# Altium schematic sheet 40.SchDoc
size 513 x 386 mm
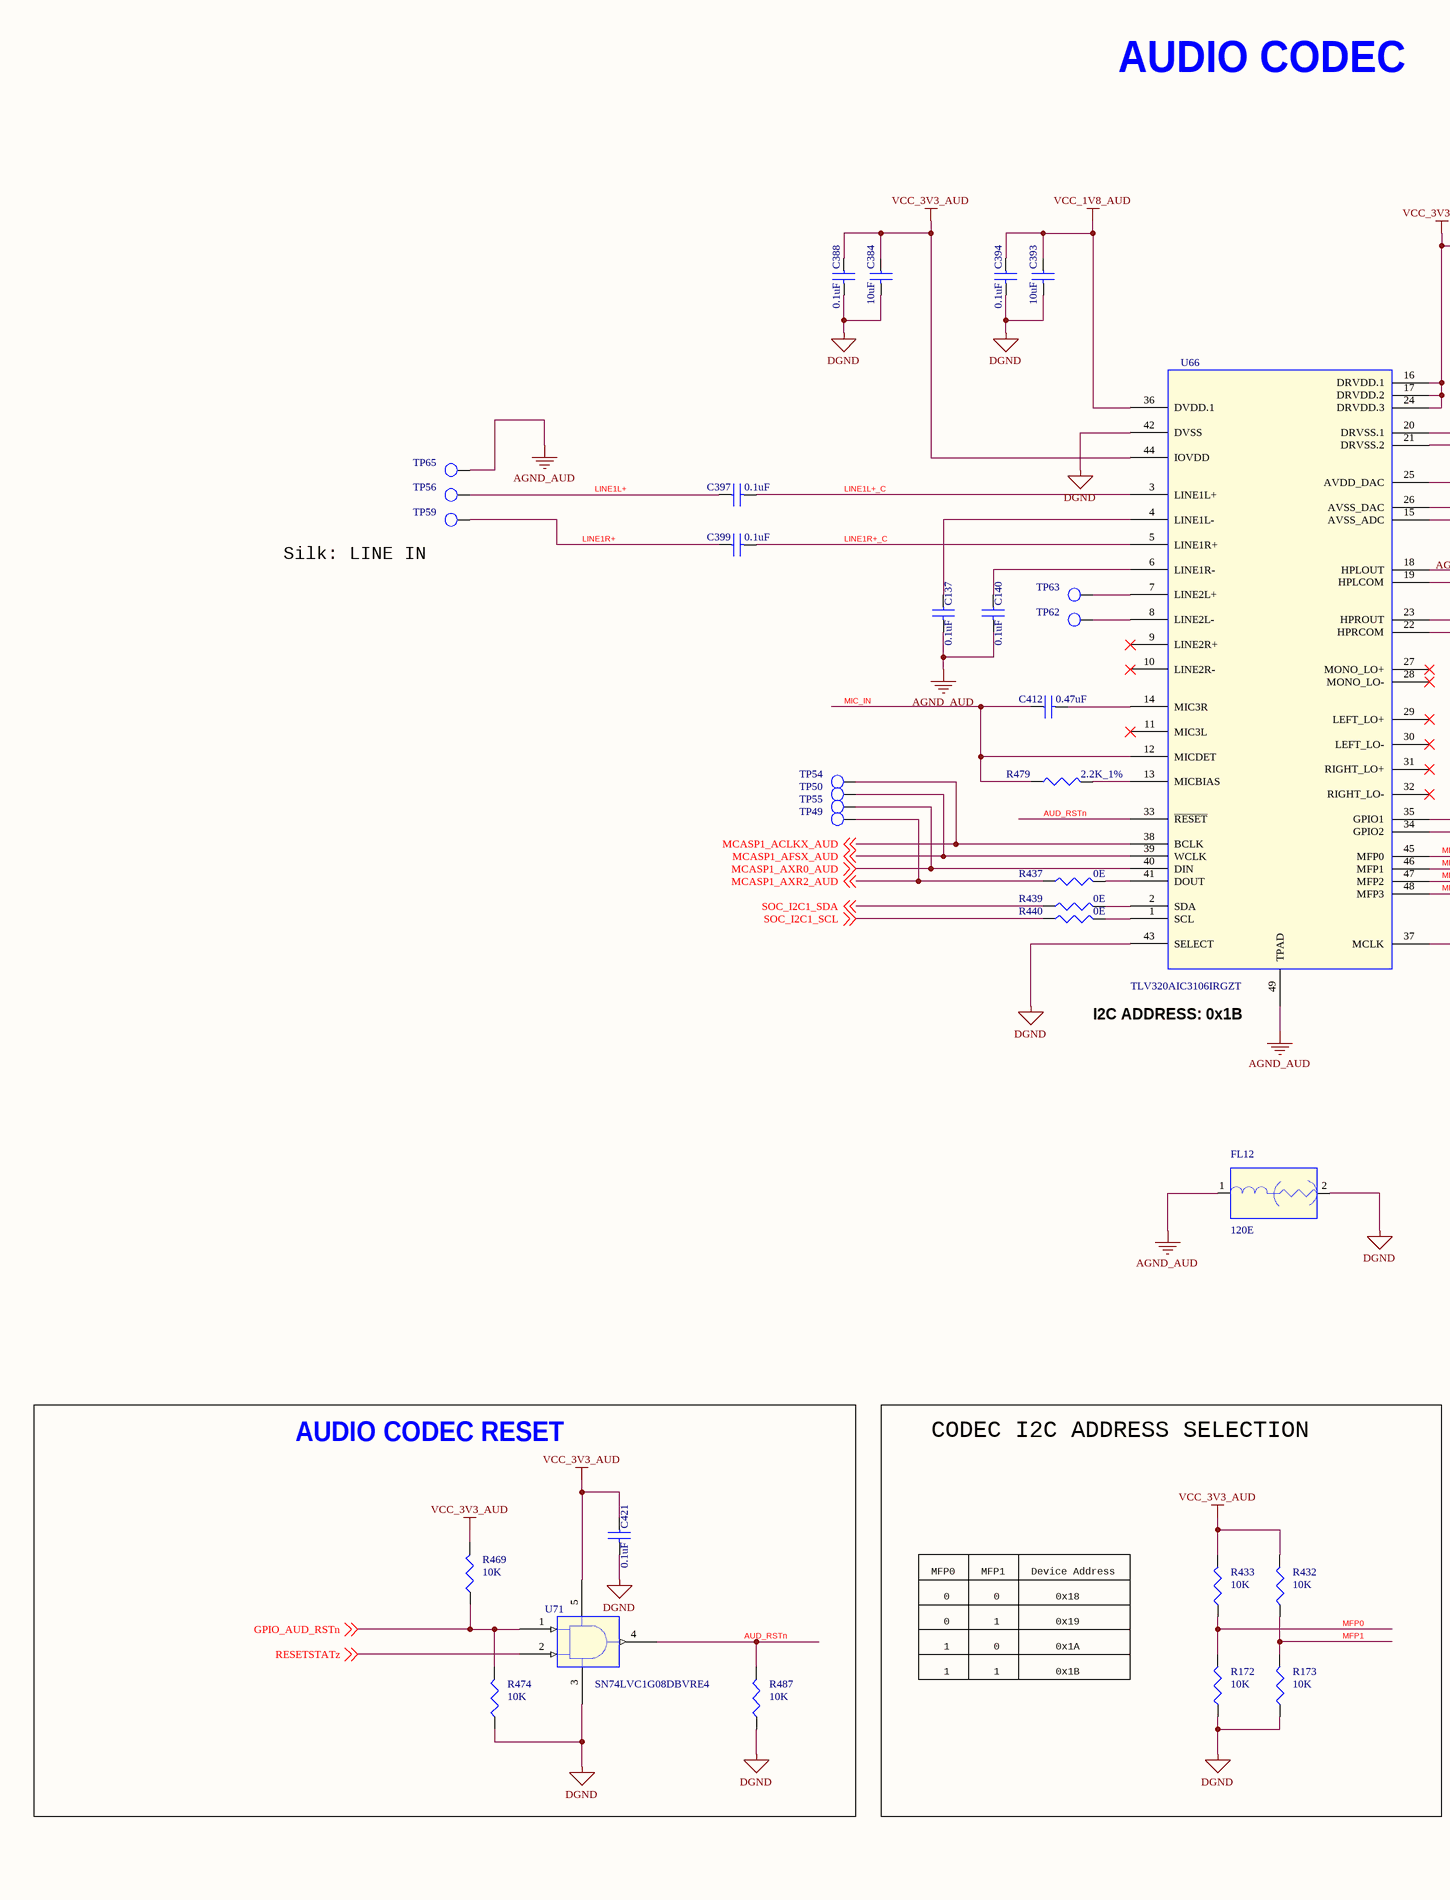
[diagram p0: 40.SchDoc, left]
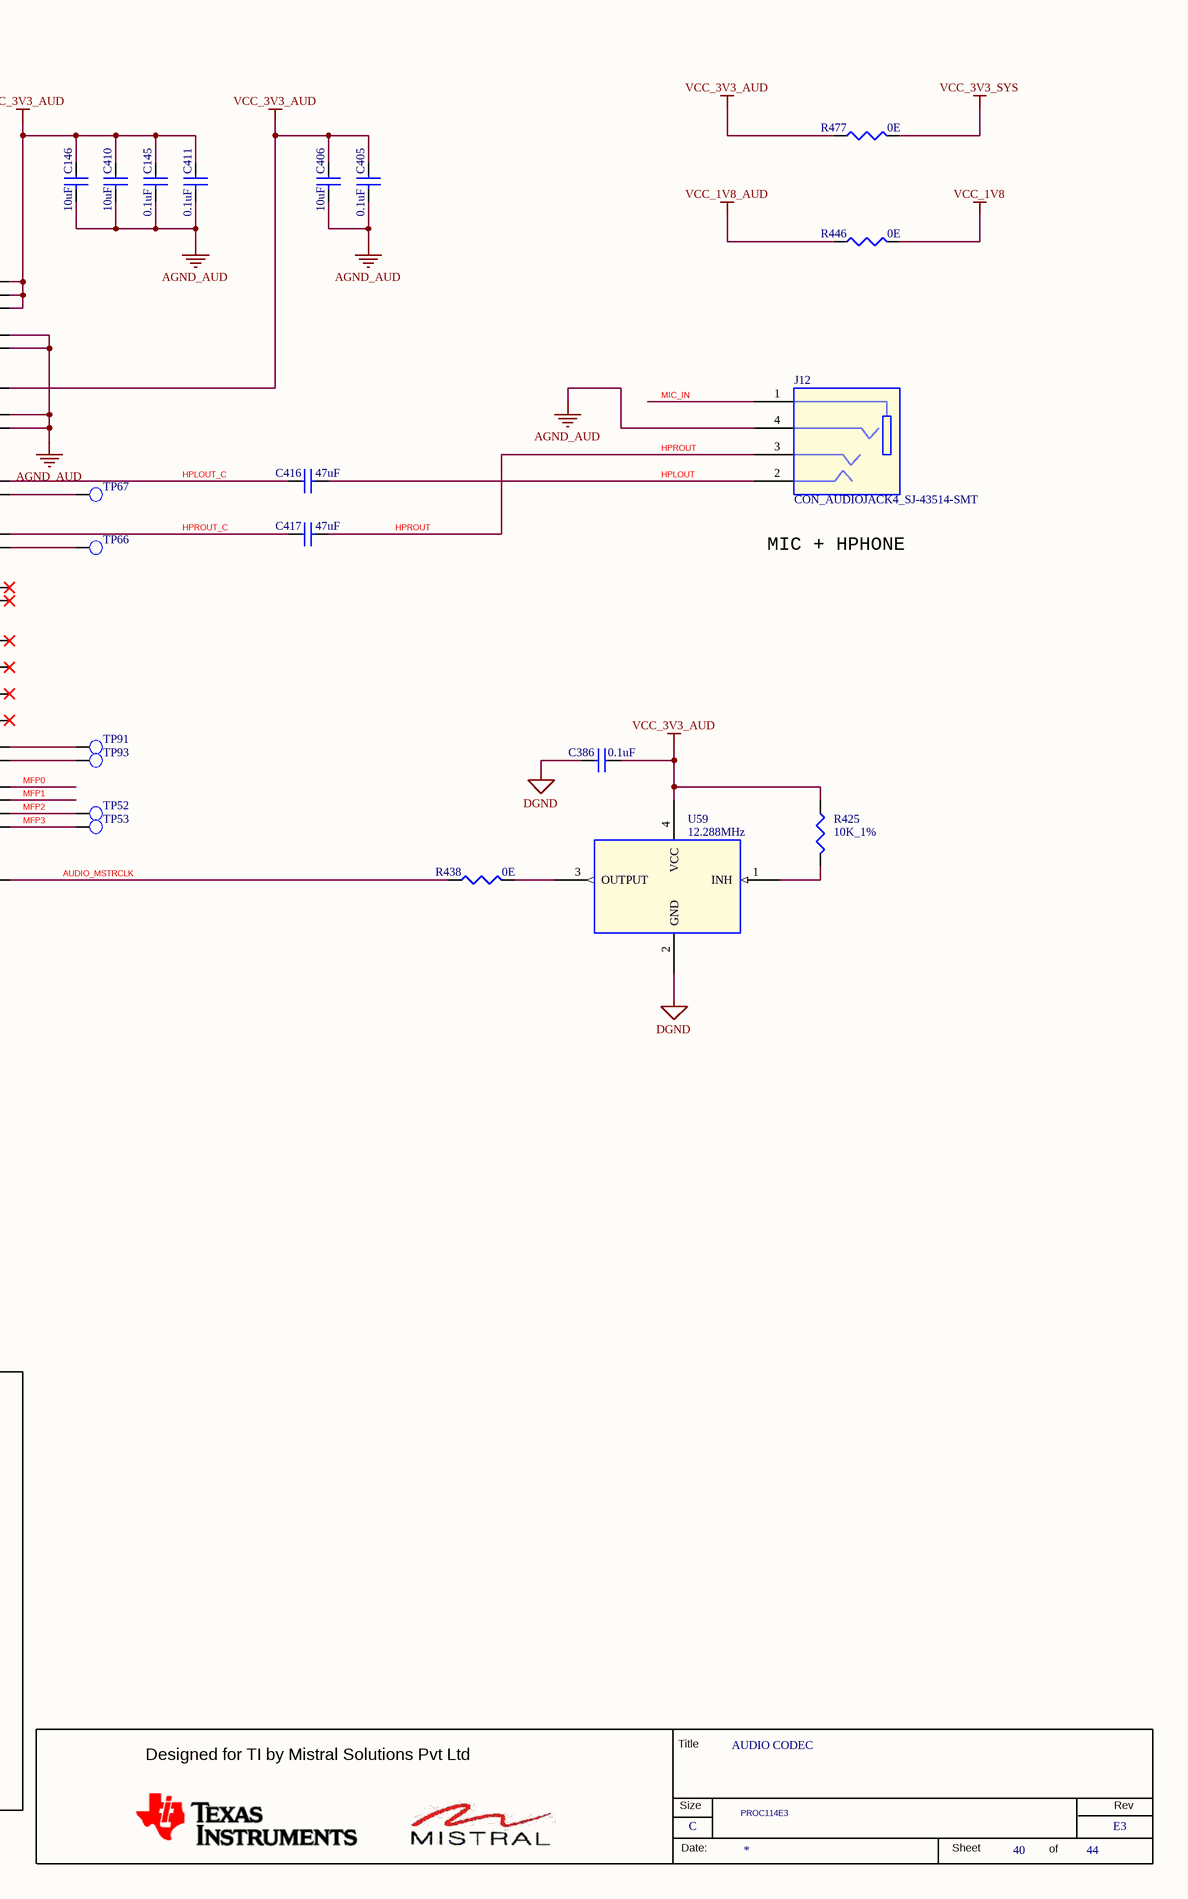
[diagram p1: 40.SchDoc, right]

## Parts
*  RevCode: E3  Title: AUDIO CODEC  Page Size: C  Page Number: 40  Page Count: 44  Variant Name: PROC114E3  (hidden comment: MISTRAL_TITLEBLK_CSIZE)  (graphical)
C137  0.1uF  [CAP0201_0-5]
C140  0.1uF  [CAP0201_0-5]
C145  0.1uF  [CAP0201_0-5]
C146  10uF  [CAP0402_0-75]
C384  10uF  [CAP0402_0-75]
C386  0.1uF  [CAP0201_0-5]
C388  0.1uF  [CAP0201_0-5]
C393  10uF  [CAP0402_0-75]
C394  0.1uF  [CAP0201_0-5]
C397  0.1uF  [CAP0402_0-75]
C399  0.1uF  [CAP0402_0-75]
C405  0.1uF  [CAP0201_0-5]
C406  10uF  [CAP0402_0-75]
C410  10uF  [CAP0402_0-75]
C411  0.1uF  [CAP0201_0-5]
C412  0.47uF  [CAP0402_0-75]
C416  47uF  [CAP1206_2]
C417  47uF  [CAP1206_2]
C421  0.1uF  [CAP0402_0-75]
FL12  120E  [EMIFIL_BLM15A_0402_0-6]
J12  CON_AUDIOJACK4_SJ-43514-SMT  [CON_AV4_SJ-43514-SMT_S_R_S_5-1]
R172  10K  [RES0201_0-5]
R173  10K  [RES0201_0-5]
R425  10K_1%  [RES0201_0-5]
R432  10K  [RES0201_0-5]
R433  10K  [RES0201_0-5]
R437  0E  [RES0201_0-5]
R438  0E  [RES0201_0-5]
R439  0E  [RES0201_0-5]
R440  0E  [RES0201_0-5]
R446  0E  [RES0201_0-5]
R469  10K  [RES0201_0-5]
R474  10K  [RES0201_0-5]
R477  0E  [RES0201_0-5]
R479  2.2K_1%  [RES0201_0-5]
R487  10K  [RES0201_0-5]
TP49  TP20_SMD  [TP20_SMD]  (value not drawn)
TP50  TP20_SMD  [TP20_SMD]  (value not drawn)
TP52  TP20_SMD  [TP20_SMD]  (value not drawn)
TP53  TP20_SMD  [TP20_SMD]  (value not drawn)
TP54  TP20_SMD  [TP20_SMD]  (value not drawn)
TP55  TP20_SMD  [TP20_SMD]  (value not drawn)
TP56  THRU HOLE  [TP_40X65]  (value not drawn)
TP59  THRU HOLE  [TP_40X65]  (value not drawn)
TP62  TP20_SMD  [TP20_SMD]  (value not drawn)
TP63  TP20_SMD  [TP20_SMD]  (value not drawn)
TP65  THRU HOLE  [TP_40X65]  (value not drawn)
TP66  TP20_SMD  [TP20_SMD]  (value not drawn)
TP67  TP20_SMD  [TP20_SMD]  (value not drawn)
TP91  TP20_SMD  [TP20_SMD]  (value not drawn)
TP93  TP20_SMD  [TP20_SMD]  (value not drawn)
U59  12.288MHz  [OSC4_KC2520B_100X80_SMD_0-8]
U66  TLV320AIC3106IRGZT  [VQFN48_19-68_285X285]
U71  SN74LVC1G08DBVRE4  [SOT23-5]

## Blocks framed on the sheet
AUDIO CODEC RESET: C421 R469 R474 R487 U71
CODEC I2C ADDRESS SELECTION: R172 R173 R432 R433

## Nets
AGND_AUD: C137.2 C140.2 C145.2 C146.2 C405.2 C406.2 C410.2 C411.2 FL12.1 J12.4 TP65.1(TP) U66.15(AVSS_ADC) U66.20(DRVSS.1) U66.21(DRVSS.2) U66.26(AVSS_DAC) U66.49(TPAD)
DGND: C384.2 C386.2 C388.2 C393.2 C394.2 C421.2 FL12.2 R172.2 R173.2 R474.1 R487.1 U59.2(GND) U66.42(DVSS) U66.43(SELECT) U71.3(GND)
VCC_1V8: R446.2
VCC_1V8_AUD: C393.1 C394.1 R446.1 U66.36(DVDD.1)
VCC_3V3_AUD: C145.1 C146.1 C384.1 C386.1 C388.1 C405.1 C406.1 C410.1 C411.1 C421.1 R425.1 R432.1 R433.1 R469.2 R477.1 U59.4(VCC) U66.16(DRVDD.1) U66.17(DRVDD.2) U66.24(DRVDD.3) U66.25(AVDD_DAC) U66.44(IOVDD) U71.5(VCC)
VCC_3V3_SYS: R477.2
AUD_RSTn: R487.2 U66.33(~{RESET}) U71.4(Y)
AUDIO_MSTRCLK: R438.1 U66.37(MCLK)
GPIO_AUD_RSTn: R469.1 R474.2 U71.1(A) ; off-sheet GPIO_AUD_RSTn
HPLOUT: C416.2 J12.2
HPLOUT_C: C416.1 U66.18(HPLOUT)
HPROUT: C417.2 J12.3
HPROUT_C: C417.1 U66.23(HPROUT)
LINE1L+: C397.1 TP56.1(TP)
LINE1L+_C: C397.2 U66.3(LINE1L+)
LINE1R+: C399.1 TP59.1(TP)
LINE1R+_C: C399.2 U66.5(LINE1R+)
MCASP1_ACLKX_AUD: TP54.1(TP) U66.38(BCLK) ; off-sheet MCASP1_ACLKX_AUD
MCASP1_AFSX_AUD: TP50.1(TP) U66.39(WCLK) ; off-sheet MCASP1_AFSX_AUD
MCASP1_AXR0_AUD: TP55.1(TP) U66.40(DIN) ; off-sheet MCASP1_AXR0_AUD
MCASP1_AXR2_AUD: R437.1 TP49.1(TP) ; off-sheet MCASP1_AXR2_AUD
MFP0: R172.1 R433.2 U66.45(MFP0)
MFP1: R173.1 R432.2 U66.46(MFP1)
MFP2: TP52.1(TP) U66.47(MFP2)
MFP3: TP53.1(TP) U66.48(MFP3)
MIC_IN: C412.1 J12.1 R479.1 U66.12(MICDET)
RESETSTATz: U71.2(B) ; off-sheet RESETSTATz
SOC_I2C1_SCL: R440.1 ; off-sheet SOC_I2C1_SCL
SOC_I2C1_SDA: R439.1 ; off-sheet SOC_I2C1_SDA
NetC137_1: C137.1 U66.4(LINE1L-)
NetC140_1: C140.1 U66.6(LINE1R-)
NetC412_2: C412.2 U66.14(MIC3R)
NetR425_2: R425.2 U59.1(INH)
NetR437_2: R437.2 U66.41(DOUT)
NetR438_2: R438.2 U59.3(OUTPUT)
NetR439_2: R439.2 U66.2(SDA)
NetR440_2: R440.2 U66.1(SCL)
NetR479_2: R479.2 U66.13(MICBIAS)
NetTP62_1: TP62.1(TP) U66.8(LINE2L-)
NetTP63_1: TP63.1(TP) U66.7(LINE2L+)
NetTP66_1: TP66.1(TP) U66.22(HPRCOM)
NetTP67_1: TP67.1(TP) U66.19(HPLCOM)
NetTP91_1: TP91.1(TP) U66.35(GPIO1)
NetTP93_1: TP93.1(TP) U66.34(GPIO2)

Not connected (* = marked no-connect by the designer): U66 9(LINE2R+)* 10(LINE2R-)* 11(MIC3L)* 27(MONO_LO+)* 28(MONO_LO-)* 29(LEFT_LO+)* 30(LEFT_LO-)* 31(RIGHT_LO+)* 32(RIGHT_LO-)*

## Notes on the sheet
- AUDIO CODEC
- Silk: LINE IN
- MIC + HPHONE
- (near U66) I2C ADDRESS: 0x1B
- MFP0
- MFP1
- Device Address
- 0
- 1
- 0x18
- 0x19
- 0x1A
- 0x1B
- (in symbol MISTRAL_TITLEBLK_CSIZE) Title; Designed for TI by Mistral Solutions Pvt Ltd; Size; Rev; Date:; Sheet; of

## Library data of the parts
* = MISTRAL_TITLEBLK_CSIZE: Issue: 1.0; Page Create Date: March  8, 1995; Page Modify Date: *; Schematic Page Count: 44; Schematic Page Number: 40
C137 C140 C386 C388 C394 C405 C411 = CAP_Dup2: CAP CERAMIC 0.1uF 16V 10% X5R 0201; Part_type: CAPACITORS\CERAMIC; Mfr_part_number: GRM033R61C104KE14D; Mfr_name: MURATA; Mistral Part No: 120009030072-R; Custom_Duty: 15%; Customs_HS_Code: 85322990; Wattage: NA; Project: TI_MAXIE_CPB; PCB Footprint: CAP0201_0-5; Footprint Path: Y:\MIS_DATABASE\Library\ALTIUM_TOOL\PCB_FOOTPRINTS\Altium_Footprint_Lib.PcbLib; Library Path: Y:\MIS_DATABASE\Library\ALTIUM_TOOL\SCHEMATICS_PARTS\MS_DISCRETE_Library.schlib; MECHANICAL 3D STEP FILE: CAP0201_0-5; Chkd/date: MANIRAJA/230118; Crtd /date: MANIRAJA/230118; Datasheet: Y:\MIS_DATABASE\DATASHEETS\CAPACITORS\GRM033R61C104KE14.PDF; Temperature: -55°C+85°C; Weight: 0.33mg; Height: 0.33MM; Library Ref: CAP; Distributor_part_number: 490-14305-1-ND; Distributor_name: DIGIKEY; Package: 0201; Voltage: 16V; Tolerance: 10%; Footprint Ref: CAP0201_0-5
C145 = CAP_Dup2: CAP CERAMIC 0.1uF 16V 10% X5R 0201; Mistral Part No: 120009030072-R; Mfr_name: MURATA; Mfr_part_number: GRM033R61C104KE14D; Part_type: CAPACITORS\CERAMIC; Project: TI_MAXIE_CPB; Wattage: NA; Customs_HS_Code: 85322990; Custom_Duty: 15%; Footprint Ref: CAP0201_0-5; Tolerance: 10%; Voltage: 16V; Package: 0201; Distributor_name: DIGIKEY; Distributor_part_number: 490-14305-1-ND; Library Ref: CAP; Height: 0.33MM; Weight: 0.33mg; Temperature: -55°C+85°C; Datasheet: Y:\MIS_DATABASE\DATASHEETS\CAPACITORS\GRM033R61C104KE14.PDF; Crtd /date: MANIRAJA/230118; Chkd/date: MANIRAJA/230118; MECHANICAL 3D STEP FILE: CAP0201_0-5; Library Path: Y:\MIS_DATABASE\Library\ALTIUM_TOOL\SCHEMATICS_PARTS\MS_DISCRETE_Library.schlib; Footprint Path: Y:\MIS_DATABASE\Library\ALTIUM_TOOL\PCB_FOOTPRINTS\Altium_Footprint_Lib.PcbLib; PCB Footprint: CAP0201_0-5
C146 C384 C393 C406 C410 = CAP_Dup2: CAP CERAMIC 10uF 10V 20% X5R 0402; Part_type: CAPACITORS\CERAMIC; Mfr_part_number: GRM155R61A106ME11D; Mfr_name: MURATA; Mistral Part No: 120013110019-R; Custom_Duty: 15%; Customs_HS_Code: 85322990; Wattage: NA; Project: QCS610_NANOSOM; PCB Footprint: CAP0402_0-75; Footprint Path: Y:\MIS_DATABASE\Library\ALTIUM_TOOL\PCB_FOOTPRINTS\Altium_Footprint_Lib.PcbLib; Library Path: Y:\MIS_DATABASE\Library\ALTIUM_TOOL\SCHEMATICS_PARTS\MS_DISCRETE_Library.schlib; MECHANICAL 3D STEP FILE: CAP0402_0-75; Chkd/date: MANIRAJA/300520; Crtd /date: ALVY/260520; Datasheet: Y:\MIS_DATABASE\DATASHEETS\CAPACITORS\MURATA-GXX-SER_NOV17.PDF; Temperature: -55°C+85°C; Weight: 3.1mg; Height: 0.55MM; Footprint Ref: CAP0402_0-75; Library Ref: CAP; Distributor_part_number: 490-GRM155R61A106ME11DTR-ND; Distributor_name: DIGIKEY; Package: 0402; Voltage: 10V; Tolerance: 20%
C397 C421 = CAP_Dup2: CAP CERAMIC 0.1uF 50V 10% X7R 0402; Mistral Part No: 120011100014-R; Mfr_name: MURATA; Mfr_part_number: GRM155R71H104KE14D; Part_type: CAPACITORS\CERAMIC; Project: J7_CP; Wattage: NA; Customs_HS_Code: 85322990; Custom_Duty: 15%; PCB Footprint: CAP0402_0-75; Tolerance: 10%; Voltage: 50V; Package: 0402; Distributor_name: DIGIKEY; Distributor_part_number: 490-10700-1-ND; Library Ref: CAP; Footprint Ref: CAP0402_0-75; Height: 0.55MM; Weight: 3.1mg; Temperature: -55°C+125°C; Datasheet: Y:\MIS_DATABASE\DATASHEETS\CAPACITORS\GRM155R71H104KE14.PDF; Crtd /date: ALVY/211020; Chkd/date: MANIRAJA/261020; MECHANICAL 3D STEP FILE: CAP0402_0-75; Library Path: Y:\MIS_DATABASE\Library\ALTIUM_TOOL\SCHEMATICS_PARTS\MS_DISCRETE_Library.schlib; Footprint Path: Y:\MIS_DATABASE\Library\ALTIUM_TOOL\PCB_FOOTPRINTS\Altium_Footprint_Lib.PcbLib
C399 = CAP_Dup2: CAP CERAMIC 0.1uF 50V 10% X7R 0402; Part_type: CAPACITORS\CERAMIC; Mfr_part_number: GRM155R71H104KE14D; Mfr_name: MURATA; Mistral Part No: 120011100014-R; Custom_Duty: 15%; Customs_HS_Code: 85322990; Wattage: NA; Project: J7_CP; PCB Footprint: CAP0402_0-75; Footprint Path: Y:\MIS_DATABASE\Library\ALTIUM_TOOL\PCB_FOOTPRINTS\Altium_Footprint_Lib.PcbLib; Library Path: Y:\MIS_DATABASE\Library\ALTIUM_TOOL\SCHEMATICS_PARTS\MS_DISCRETE_Library.schlib; MECHANICAL 3D STEP FILE: CAP0402_0-75; Chkd/date: MANIRAJA/261020; Crtd /date: ALVY/211020; Datasheet: Y:\MIS_DATABASE\DATASHEETS\CAPACITORS\GRM155R71H104KE14.PDF; Temperature: -55°C+125°C; Weight: 3.1mg; Height: 0.55MM; Footprint Ref: CAP0402_0-75; Library Ref: CAP; Distributor_part_number: 490-10700-1-ND; Distributor_name: DIGIKEY; Package: 0402; Voltage: 50V; Tolerance: 10%
C412 = CAP_Dup2: CAP CERAMIC 0.47uF 10V 10% X7R 0402; Part_type: CAPACITORS\CERAMIC; Mfr_part_number: GRM155R71A474KE01D; Mfr_name: MURATA; Mistral Part No: 120021060019-R; Custom_Duty: 15%; Customs_HS_Code: 85322990; Wattage: NA; Project: TI_AM335x SK_BRD; PCB Footprint: CAP0402_0-75; Footprint Path: Y:\MIS_DATABASE\Library\ALTIUM_TOOL\PCB_FOOTPRINTS\Altium_Footprint_Lib.PcbLib; Library Path: Y:\MIS_DATABASE\Library\ALTIUM_TOOL\SCHEMATICS_PARTS\MS_DISCRETE_Library.schlib; MECHANICAL 3D STEP FILE: CAP0402_0-75; Chkd/date: MANIRAJA/310821; Crtd /date: ALVY/310821; Datasheet: Y:\MIS_DATABASE\DATASHEETS\CAPACITORS\GRM155R71A474KE01.PDF; Temperature: -55°C+125°C; Weight: 1.5mg; Height: 0.55MM; Library Ref: CAP; Distributor_part_number: 490-14366-1-ND; Distributor_name: DIGIKEY; Package: 0402; Voltage: 10V; Tolerance: 10%; Footprint Ref: CAP0402_0-75
C416 C417 = CAP_Dup2: CAP CERAMIC 47uF 10V 20% X5R 1206; Part_type: CAPACITORS\CERAMIC; Mfr_part_number: GRM31CR61A476ME15L; Mfr_name: MURATA; Mistral Part No: 120013120015-R; Custom_Duty: 15%; Customs_HS_Code: 85322990; Wattage: NA; Project: DMP; Footprint Path: Y:\MIS_DATABASE\Library\ALTIUM_TOOL\PCB_FOOTPRINTS\Altium_Footprint_Lib.PcbLib; Library Path: Y:\MIS_DATABASE\Library\ALTIUM_TOOL\SCHEMATICS_PARTS\MS_DISCRETE_Library.schlib; MECHANICAL 3D STEP FILE: CAP1206_2; Chkd/date: USMAN/121213; Crtd /date: USMAN/121213; Datasheet: Y:\MIS_DATABASE\DATASHEETS\CAPACITORS\MURATA-GXX-SER_NOV17.PDF; Temperature: -55°C+85°C; Weight: 40mg; Height: 1.80MM; Footprint Ref: CAP1206_2; Library Ref: CAP; Distributor_part_number: 490-5528-1-ND; Distributor_name: DIGIKEY; Package: 1206; Voltage: 10V; Tolerance: 20%; PCB Footprint: CAP1206_2
FL12 = EMIFILTER_IND: IND FERRITE BEAD CHIP 120E 2A 0402; Mistral Part No: 130013060022-R; Mfr_name: MURATA; Mfr_part_number: BLM15PX121SN1D; Part_type: INDUCTOR; Project: GEN_3-8; Tolerance: 25%; Voltage: NA; Customs_HS_Code: 85369090; Custom_Duty: 24%; PCB Footprint: EMIFIL_BLM15A_0402_0-6; Footprint Ref: EMIFIL_BLM15A_0402_0-6; Wattage: NA; Package: 0402; Distributor_name: DIGIKEY; Distributor_part_number: 490-9656-1-ND; Library Ref: EMIFILTER_IND; Height: 0.55MM; Weight: 1mg; Temperature: -55°C+125°C; Datasheet: Y:\MIS_DATABASE\DATASHEETS\DISCRETES\INDUCTORS\BLM15-SN1-SER.PDF; Crtd /date: USMAN/170613; Chkd/date: NAVEED/241114; MECHANICAL 3D STEP FILE: EMIFIL_BLM15A_0402_0-6; Library Path: Y:\MIS_DATABASE\Library\ALTIUM_TOOL\SCHEMATICS_PARTS\MS_FILTER_Library.schlib; Footprint Path: Y:\MIS_DATABASE\Library\ALTIUM_TOOL\PCB_FOOTPRINTS\Altium_Footprint_Lib.PcbLib
J12 = CON_AUDIOJACK4_SJ-43514-SMT: CON AUDIO JACK 4POS FEMALE RT SMD; Mistral Part No: 150010060028-R; Mfr_name: CUI INC; Mfr_part_number: SJ-43514-SMT-TR; Part_type: CONNECTOR\JACK; Project: PB_BUGBASE; Tolerance: NA; Customs_HS_Code: 85369090; Custom_Duty: 24%; Footprint Ref: CON_AV4_SJ-43514-SMT_S_R_S_5-1; Voltage: NA; Wattage: NA; Package: SMD; Distributor_name: DIGIKEY; Distributor_part_number: CP-43514SJCT-ND; Library Ref: CON_AUDIOJACK4_SJ-43514-SMT; Height: 5.10MM; Weight: 1100mg; Temperature: -25°C+85°C; Datasheet: Y:\MIS_DATABASE\DATASHEETS\CONNECTORS\SJ-4351X-SMT.PDF; Crtd /date: MUDDU/300610; Chkd/date: MAZHAR/230211; MECHANICAL 3D STEP FILE: CON_AV4_SJ-43514-SMT_S_R_S_5-1; Library Path: Y:\MIS_DATABASE\Library\ALTIUM_TOOL\SCHEMATICS_PARTS\MS_CONNECTOR_Library.schlib; Footprint Path: Y:\MIS_DATABASE\Library\ALTIUM_TOOL\PCB_FOOTPRINTS\Altium_Footprint_Lib.PcbLib; PCB Footprint: CON_AV4_SJ-43514-SMT_S_R_S_5-1
R172 R173 R432 R433 = RESISTOR_Dup6: RES 10K 1/20W 5% 0201; Part_type: RESISTORS\FIXED; Mfr_part_number: RC0201JR-0710KL; Mfr_name: YAGEO AMERICA; Mistral Part No: 110010070051-R; Custom_Duty: 15%; Customs_HS_Code: 85332119; Voltage: NA; Project: GOLDEN-I LITE; Footprint Path: Y:\MIS_DATABASE\Library\ALTIUM_TOOL\PCB_FOOTPRINTS\Altium_Footprint_Lib.PcbLib; Library Path: Y:\MIS_DATABASE\Library\ALTIUM_TOOL\SCHEMATICS_PARTS\MS_DISCRETE_Library.schlib; MECHANICAL 3D STEP FILE: RES0201_0-5; Chkd/date: MANIRAJA/050517; Crtd /date: MANIRAJA/050517; Datasheet: Y:\MIS_DATABASE\DATASHEETS\RESISTORS\RCXXXXL-SER_MAR18.PDF; Temperature: -55°C+125°C; Weight: 0.17mg; Height: 0.26MM; Library Ref: RESISTOR; Distributor_part_number: 311-10KNCT-ND; Distributor_name: DIGIKEY; Package: 0201; Wattage: 1/20W; Tolerance: 5%; Footprint Ref: RES0201_0-5; PCB Footprint: RES0201_0-5
R425 = RESISTOR_Dup1: RES 10K 1/20W 1% 0201; Mistral Part No: 110011040018-R; Mfr_name: YAGEO AMERICA; Mfr_part_number: RC0201FR-0710KL; Part_type: RESISTORS\FIXED; Project: GOLDEN-I LITE; Voltage: NA; Customs_HS_Code: 85332119; Custom_Duty: 15%; PCB Footprint: RES0201_0-5; Tolerance: 1%; Wattage: 1/20W; Package: 0201; Distributor_name: DIGIKEY; Distributor_part_number: 311-10.0KMCT-ND; Library Ref: RESISTOR; Footprint Ref: RES0201_0-5; Height: 0.26MM; Weight: 0.17mg; Temperature: -55°C+125°C; Datasheet: Y:\MIS_DATABASE\DATASHEETS\RESISTORS\RCXXXXL-SER_MAR18.PDF; Crtd /date: MANIRAJA/270117; Chkd/date: VASANTHA/270117; MECHANICAL 3D STEP FILE: RES0201_0-5; Library Path: Y:\MIS_DATABASE\Library\ALTIUM_TOOL\SCHEMATICS_PARTS\MS_DISCRETE_Library.schlib; Footprint Path: Y:\MIS_DATABASE\Library\ALTIUM_TOOL\PCB_FOOTPRINTS\Altium_Footprint_Lib.PcbLib
R437 = RESISTOR_Dup1: RES 0E 1/20W 5% 0201; Part_type: RESISTORS\FIXED; Mfr_part_number: RC0201JR-070RL; Mfr_name: YAGEO AMERICA; Mistral Part No: 110010070067-R; Custom_Duty: 15%; Customs_HS_Code: 85332119; Voltage: NA; Project: PB_BUGBASE; SIGNAL_MODEL: RESISTOR_RES0201_0-5_0E_0E; Footprint Path: Y:\MIS_DATABASE\Library\ALTIUM_TOOL\PCB_FOOTPRINTS\Altium_Footprint_Lib.PcbLib; Library Path: Y:\MIS_DATABASE\Library\ALTIUM_TOOL\SCHEMATICS_PARTS\MS_DISCRETE_Library.schlib; MECHANICAL 3D STEP FILE: RES0201_0-5; Chkd/date: NAVEED/301214; Crtd /date: MUDDU/120710; Datasheet: Y:\MIS_DATABASE\DATASHEETS\RESISTORS\RCXXXXL-SER_MAR18.PDF; Temperature: -55°C+125°C; Weight: 0.17mg; Height: 0.26MM; Footprint Ref: RES0201_0-5; Library Ref: RESISTOR; Distributor_part_number: 311-0.0NCT-ND; Distributor_name: DIGIKEY; Package: 0201; Wattage: 1/20W; Tolerance: 5%; PCB Footprint: RES0201_0-5
R438-R440 = RESISTOR_Dup1: RES 0E 1/20W 5% 0201; Part_type: RESISTORS\FIXED; Mfr_part_number: RC0201JR-070RL; Mfr_name: YAGEO AMERICA; Mistral Part No: 110010070067-R; Custom_Duty: 15%; Customs_HS_Code: 85332119; Voltage: NA; Project: PB_BUGBASE; PCB Footprint: RES0201_0-5; Footprint Path: Y:\MIS_DATABASE\Library\ALTIUM_TOOL\PCB_FOOTPRINTS\Altium_Footprint_Lib.PcbLib; Library Path: Y:\MIS_DATABASE\Library\ALTIUM_TOOL\SCHEMATICS_PARTS\MS_DISCRETE_Library.schlib; MECHANICAL 3D STEP FILE: RES0201_0-5; Chkd/date: NAVEED/301214; Crtd /date: MUDDU/120710; Datasheet: Y:\MIS_DATABASE\DATASHEETS\RESISTORS\RCXXXXL-SER_MAR18.PDF; Temperature: -55°C+125°C; Weight: 0.17mg; Height: 0.26MM; Footprint Ref: RES0201_0-5; Library Ref: RESISTOR; Distributor_part_number: 311-0.0NCT-ND; Distributor_name: DIGIKEY; Package: 0201; Wattage: 1/20W; Tolerance: 5%
R446 R477 = RESISTOR_Dup6: RES 0E 1/20W 5% 0201; Part_type: RESISTORS\FIXED; Mfr_part_number: RC0201JR-070RL; Mfr_name: YAGEO AMERICA; Mistral Part No: 110010070067-R; Custom_Duty: 15%; Customs_HS_Code: 85332119; Voltage: NA; Project: PB_BUGBASE; PCB Footprint: RES0201_0-5; Footprint Path: Y:\MIS_DATABASE\Library\ALTIUM_TOOL\PCB_FOOTPRINTS\Altium_Footprint_Lib.PcbLib; Library Path: Y:\MIS_DATABASE\Library\ALTIUM_TOOL\SCHEMATICS_PARTS\MS_DISCRETE_Library.schlib; MECHANICAL 3D STEP FILE: RES0201_0-5; Chkd/date: NAVEED/301214; Crtd /date: MUDDU/120710; Datasheet: Y:\MIS_DATABASE\DATASHEETS\RESISTORS\RCXXXXL-SER_MAR18.PDF; Temperature: -55°C+125°C; Weight: 0.17mg; Height: 0.26MM; Library Ref: RESISTOR; Distributor_part_number: 311-0.0NCT-ND; Distributor_name: DIGIKEY; Package: 0201; Wattage: 1/20W; Tolerance: 5%; Footprint Ref: RES0201_0-5
R469 = RESISTOR_Dup1: RES 10K 1/20W 5% 0201; Part_type: RESISTORS\FIXED; Mfr_part_number: RC0201JR-0710KL; Mfr_name: YAGEO AMERICA; Mistral Part No: 110010070051-R; Custom_Duty: 15%; Customs_HS_Code: 85332119; Voltage: NA; Project: GOLDEN-I LITE; Footprint Path: Y:\MIS_DATABASE\Library\ALTIUM_TOOL\PCB_FOOTPRINTS\Altium_Footprint_Lib.PcbLib; Library Path: Y:\MIS_DATABASE\Library\ALTIUM_TOOL\SCHEMATICS_PARTS\MS_DISCRETE_Library.schlib; MECHANICAL 3D STEP FILE: RES0201_0-5; Chkd/date: MANIRAJA/050517; Crtd /date: MANIRAJA/050517; Datasheet: Y:\MIS_DATABASE\DATASHEETS\RESISTORS\RCXXXXL-SER_MAR18.PDF; Temperature: -55°C+125°C; Weight: 0.17mg; Height: 0.26MM; Library Ref: RESISTOR; Distributor_part_number: 311-10KNCT-ND; Distributor_name: DIGIKEY; Package: 0201; Wattage: 1/20W; Tolerance: 5%; Footprint Ref: RES0201_0-5; PCB Footprint: RES0201_0-5
R474 R487 = RESISTOR_Dup1: RES 10K 1/20W 5% 0201; Mistral Part No: 110010070051-R; Mfr_name: YAGEO AMERICA; Mfr_part_number: RC0201JR-0710KL; Part_type: RESISTORS\FIXED; Project: GOLDEN-I LITE; Voltage: NA; Customs_HS_Code: 85332119; Custom_Duty: 15%; Footprint Ref: RES0201_0-5; Tolerance: 5%; Wattage: 1/20W; Package: 0201; Distributor_name: DIGIKEY; Distributor_part_number: 311-10KNCT-ND; Library Ref: RESISTOR; Height: 0.26MM; Weight: 0.17mg; Temperature: -55°C+125°C; Datasheet: Y:\MIS_DATABASE\DATASHEETS\RESISTORS\RCXXXXL-SER_MAR18.PDF; Crtd /date: MANIRAJA/050517; Chkd/date: MANIRAJA/050517; MECHANICAL 3D STEP FILE: RES0201_0-5; Library Path: Y:\MIS_DATABASE\Library\ALTIUM_TOOL\SCHEMATICS_PARTS\MS_DISCRETE_Library.schlib; Footprint Path: Y:\MIS_DATABASE\Library\ALTIUM_TOOL\PCB_FOOTPRINTS\Altium_Footprint_Lib.PcbLib; PCB Footprint: RES0201_0-5
R479 = RESISTOR_Dup6: RES 2.2K 1/20W 1% 0201; Mistral Part No: 110017010016-R; Mfr_name: YAGEO AMERICA; Mfr_part_number: RC0201FR-072K2L; Part_type: RESISTORS\FIXED; Project: GOLDEN-I LITE; Voltage: NA; Customs_HS_Code: 85332119; Custom_Duty: 15%; PCB Footprint: RES0201_0-5; Footprint Ref: RES0201_0-5; Tolerance: 1%; Wattage: 1/20W; Package: 0201; Distributor_name: DIGIKEY; Distributor_part_number: YAG2572CT-ND; Library Ref: RESISTOR; Height: 0.26MM; Weight: 0.17mg; Temperature: -55°C+125°C; Datasheet: Y:\MIS_DATABASE\DATASHEETS\RESISTORS\RCXXXXL-SER_MAR18.PDF; Crtd /date: MANIRAJA/270117; Chkd/date: VASANTHA/270117; MECHANICAL 3D STEP FILE: RES0201_0-5; Library Path: Y:\MIS_DATABASE\Library\ALTIUM_TOOL\SCHEMATICS_PARTS\MS_DISCRETE_Library.schlib; Footprint Path: Y:\MIS_DATABASE\Library\ALTIUM_TOOL\PCB_FOOTPRINTS\Altium_Footprint_Lib.PcbLib
TP49 TP54 TP55 TP62 TP63 TP91 TP93 = TESTPOINT: TESTPOINT CIR 20 SMD; Mistral Part No: NA; Mfr_name: LOCAL; Project: BT MODULE_CSRBC04; PCB Footprint: TP20_SMD; RoHS: NA; Mfr_part_number: TP20_SMD; Part_type: TESTPOINT; Package: SMD; Distributor_name: NA; Distributor_part_number: NA; Height: NA; Crtd /date: MAZHAR/171006; Chkd/date: SHREESHAIL/171006; Tolerance: NA; Voltage: NA; Wattage: NA; Weight: NA; Temperature: NA; Datasheet: NA; MECHANICAL 3D STEP FILE: NA; Library Path: Y:\MIS_DATABASE\Library\ALTIUM_TOOL\SCHEMATICS_PARTS\MS_DISCRETE_Library.schlib; Footprint Path: Y:\MIS_DATABASE\Library\ALTIUM_TOOL\PCB_FOOTPRINTS\Altium_Footprint_Lib.PcbLib; Library Ref: TESTPOINT; Footprint Ref: TP20_SMD; Customs_HS_Code: NA; Custom_Duty: NA
TP50 TP52 TP53 TP66 TP67 = TESTPOINT: TESTPOINT CIR 20 SMD; Mfr_name: LOCAL; Custom_Duty: NA; Project: BT MODULE_CSRBC04; PCB Footprint: TP20_SMD; Customs_HS_Code: NA; Footprint Ref: TP20_SMD; Library Ref: TESTPOINT; Footprint Path: Y:\MIS_DATABASE\Library\ALTIUM_TOOL\PCB_FOOTPRINTS\Altium_Footprint_Lib.PcbLib; Library Path: Y:\MIS_DATABASE\Library\ALTIUM_TOOL\SCHEMATICS_PARTS\MS_DISCRETE_Library.schlib; MECHANICAL 3D STEP FILE: NA; Datasheet: NA; Temperature: NA; Weight: NA; Wattage: NA; Voltage: NA; Tolerance: NA; Chkd/date: SHREESHAIL/171006; Crtd /date: MAZHAR/171006; Height: NA; Distributor_part_number: NA; Distributor_name: NA; Package: SMD; Part_type: TESTPOINT; Mfr_part_number: TP20_SMD; Mistral Part No: NA; RoHS: NA
TP56 TP59 = TESTPOINT: TESTPOINT 1.0MM DRILL PTH; Mistral Part No: 130009030938; Mfr_name: LOCAL; Project: HSE; PCB Footprint: TP_40X65; Mfr_part_number: TP_40X65; Part_type: TESTPOINT; Package: THRU-HOLE; Distributor_name: NA; Distributor_part_number: NA; Height: NA; Crtd /date: SHREESHAIL/041005; Chkd/date: MAZHAR/271211; Datasheet: NA; Library Ref: TESTPOINT
TP65 = TESTPOINT: TESTPOINT 1.0MM DRILL PTH; Mfr_name: LOCAL; Mistral Part No: 130009030938; Project: HSE; PCB Footprint: TP_40X65; Library Ref: TESTPOINT; Datasheet: NA; Chkd/date: MAZHAR/271211; Crtd /date: SHREESHAIL/041005; Height: NA; Distributor_part_number: NA; Distributor_name: NA; Package: THRU-HOLE; Part_type: TESTPOINT; Mfr_part_number: TP_40X65
U59 = OSC_KC2016K: OSC 12.288MHz CMOS SMD; Part_type: OSCILLATORS; Mfr_part_number: KC2520Z12.2880C1KX00; Mfr_name: KYOCERA; Mistral Part No: 130021100008-R; Custom_Duty: 24%; Customs_HS_Code: 85437099; Wattage: NA; Project: TI_AM62x SKEVM_BRD; PCB Footprint: OSC4_KC2520B_100X80_SMD_0-8; Footprint Path: Y:\MIS_DATABASE\Library\ALTIUM_TOOL\PCB_FOOTPRINTS\Altium_Footprint_Lib.PcbLib; Library Path: Y:\MIS_DATABASE\Library\ALTIUM_TOOL\SCHEMATICS_PARTS\MS_DISCRETE_Library.schlib; MECHANICAL 3D STEP FILE: OSC4_KC2520B_100X80_SMD_0-8; Chkd/date: MANIRAJA/061021; Crtd /date: ALVY/061021; Datasheet: Y:\MIS_DATABASE\DATASHEETS\MISC\CRY_OSC\KC-Z-SERPDF; Temperature: -40°C+85°C; Weight: NA; Height: 0.80MM; Library Ref: OSC_KC2016K; Distributor_part_number: 1253-KC2520Z12.2880C1KX00CT-ND; Distributor_name: DIGIKEY; Package: SMD; Voltage: NA; Tolerance: NA; Footprint Ref: OSC4_KC2520B_100X80_SMD_0-8
U66 = TLV320AIC3106IRGZT_VQFN48: IC LOW-POWER STEREO AUDIO CODEC VQFN48; Part_type: ICS\TELECOM\CODEC; Mfr_name: TEXAS INSTRUMENTS; Mistral Part No: 143010060003-R; Custom_Duty: 15%; Customs_HS_Code: 85423100; Project: CENTAURUS; PCB Footprint: VQFN48_19-68_285X285; RoHS: Sb/ Br FREE; Chkd/date: SUHAS/261010; Crtd /date: MUDDU/150610; Datasheet: Y:\MIS_DATABASE\DATASHEETS\ICS\TELECOM\TLV320AIC3106IRGZT.PDF; Temperature: -40°C+85°C; Weight: NA; Height: 1.00MM; Library Ref: TLV320AIC3106IRGZT_VQFN48; Distributor_part_number: TLV320AIC3106IRGZT-ND; Distributor_name: DIGIKEY; Package: VQFN48; Mfr_part_number: TLV320AIC3106IRGZT
U71 = SN74LVC1G08DBVRE4_SOT23-5_Dup1: IC SINGLE 2-INPUT POSITIVE AND GATE SOT23-5; Part_type: ICS\DIGITAL\GATES; Mfr_name: TEXAS INSTRUMENTS; Mistral Part No: 141009060026-R; Custom_Duty: 15%; Customs_HS_Code: 85423100; Project: KHAN_MAIN; RoHS: Sb/ Br FREE; Chkd/date: SUHAS/221010; Crtd /date: USMAN/151008; Datasheet: Y:\MIS_DATABASE\DATASHEETS\ICS\DIGITAL\GATES\SN74LVC1G08.PDF; Temperature: -40°C+85°C; Height: 1.45MM; Library Ref: SN74LVC1G08DBVRE4_SOT23-5; Distributor_part_number: SN74LVC1G08DBVRE4-ND; Distributor_name: DIGIKEY; Package: SOT23-5; Mfr_part_number: SN74LVC1G08DBVRE4; PCB Footprint: SOT23-5